# Altium schematic sheet P+EV.SchDoc
size A4
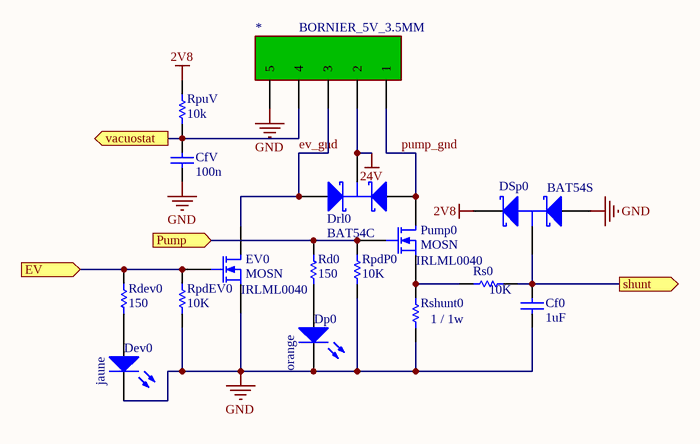
[diagram p0: P+EV.SchDoc]

## Parts
*  BORNIER_5V_3.5MM  [BORNIER_5V_3.5MM_femelle_90]
Cf0  1uF  [C0805_N]
CfV  100n  [C0805_N]
Dev0  jaune  [LED_0805]
Dp0  orange  [LED_0805]
Drl0  BAT54C  [SOT23-3N]
DSp0  BAT54S  [SOT23-3N]
EV0  MOSN  [SOT23-3N]
Pump0  MOSN  [SOT23-3N]
Rd0  150  [R1206_N]
Rdev0  150  [R1206_N]
RpdEV0  10K  [R1206_N]
RpdP0  10K  [R1206_N]
RpuV  10k  [R1206_N]
Rs0  10K  [R1206_N]
Rshunt0  1 / 1w  [INDUCTANCE_CMS_1812]

## Ports
EV (in), Pump (in), shunt (out), vacuostat (out)

## Nets
2V8: DSp0.2(K) RpuV.2
24V: *.2 Drl0.3(K)
GND: *.5 Cf0.1 CfV.1 Dev0.2(K) Dp0.2(K) DSp0.1(A) EV0.2(S) RpdEV0.1 RpdP0.1 Rshunt0.1
EV: EV0.1(G) Rdev0.2 RpdEV0.2 ; port EV
ev_gnd: *.3 Drl0.1(A1) EV0.3(D)
Pump: Pump0.1(G) Rd0.2 RpdP0.2 ; port Pump
pump_gnd: *.1 Drl0.2(A2) Pump0.3(D)
shunt: Cf0.2 DSp0.3(C) Rs0.2 ; port shunt
vacuostat: *.4 CfV.2 RpuV.1 ; port vacuostat
NetDev0_1: Dev0.1(A) Rdev0.1
NetDp0_1: Dp0.1(A) Rd0.1
NetPump0_2: Pump0.2(S) Rs0.1 Rshunt0.2

## Notes on the sheet
- (in symbol Transistor MOSFET-N) IRLML0040

## Library data of the parts
Cf0 CfV = Condensateur: Capacitor; Published: 8-Jun-2000; LatestRevisionDate: 17-Jul-2002; LatestRevisionNote: Re-released for DXP Platform.; PackageReference: RAD-0.3; Publisher: Altium Limited
Dev0 Dp0 = LED: Typical LED; Published: 8-Jun-2000; LatestRevisionDate: 08-Jul-2005; LatestRevisionNote: Mech Layer 1 removed.; PackageReference: LED-1; Publisher: Altium Limited
Drl0 = Diode Shottky double BAT54C: DIODE SCHOTTKY DOUBLE; Manufacturer: ZETEX; Diode Case Style: SOT-23; Supplier Part Number: 9526501; Supplier: Farnell; ComponentLink1URL: http://www.farnell.com/datasheets/27632.pdf; ComponentLink1Description: http://www.farnell.com/datasheets/27632.pdf; Pricing: 5=0,32, 25=0,23, 100=0,198, 1000=0,154 (EUR); RoHS: YES; Manufacturer Part Number: BAT54C
DSp0 = Diode Shottky double BAT54S: DIODE SCHOTTKY DOUBLE; Manufacturer: ZETEX; ComponentLink1URL: http://www.farnell.com/datasheets/27632.pdf; ComponentLink1Description: http://www.farnell.com/datasheets/27632.pdf; Supplier: Farnell; RoHS: YES; Supplier Part Number: 9526510; Pricing: 5=0,32, 25=0,26, 100=0,21, 1000=0,17 (EUR); Manufacturer Part Number: BAT54S
EV0 Pump0 = Transistor MOSFET-N: N-Channel MOSFET; PackageDocument: 1995/1996; Published: 8-Jun-2000; LatestRevisionDate: 17-Jul-2002; LatestRevisionNote: Re-released for DXP Platform.; PackageReference: E3; Publisher: Altium Limited
Rd0 Rdev0 RpdEV0 RpdP0 RpuV Rs0 Rshunt0 = Resistor: Published: 8-Jun-2000; LatestRevisionDate: 17-Jul-2002; LatestRevisionNote: Re-released for DXP Platform.; PackageReference: AXIAL-0.5; Publisher: Altium Limited